# Altium project PCB_Robot_Sumo_2024.PrjPcb
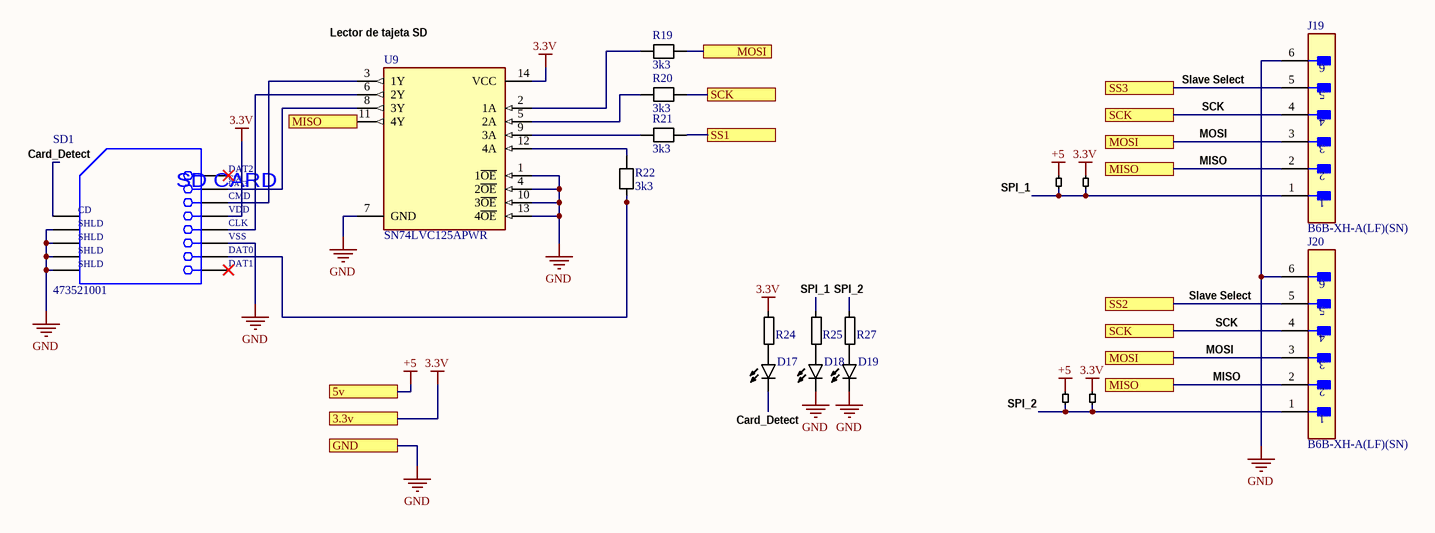
[diagram p0: SPI.SchDoc]
4 sheets, 41 parts. Net scope: flat (ports and power ports of the same name join across sheets).
Board file: PCB1.PcbDoc
Sheets:
  SPI.SchDoc
  QTR.SchDoc
  UART.SchDoc
  Drivers.SchDoc

## Sheet SPI.SchDoc
size A4

### Parts
D17  597-3305-607F  [0805 LED]  (value not drawn)
D18  597-3305-607F  [0805 LED]  (value not drawn)
D19  597-3305-607F  [0805 LED]  (value not drawn)
J19  B6B-XH-A(LF)(SN)  [FP-B6B-XH-A_LF_SN-MFG]
J20  B6B-XH-A(LF)(SN)  [FP-B6B-XH-A_LF_SN-MFG]
R19  3k3  [1206]
R20  3k3  [1206]
R21  3k3  [1206]
R22  3k3  [1206]
R24  CR0805-JW-221ELF  [0805 res]  (value not drawn)
R25  CR0805-JW-221ELF  [0805 res]  (value not drawn)
R27  CR0805-JW-221ELF  [0805 res]  (value not drawn)
SD1  473521001  [MOLX-473521001_V]
U9  SN74LVC125APWR  [FP-PW0014A-IPC_B]
W2  Jumper  [Jumper Mid]  (value not drawn)
W9  Jumper  [Jumper Mid]  (value not drawn)
W10  Jumper  [Jumper Mid]  (value not drawn)
W11  Jumper  [Jumper Mid]  (value not drawn)

### Ports
3.3v, 5v, GND, MISO, MOSI, SCK, SS1, SS2, SS3

### Nets
3.3V: R24.1 SD1.4(VDD) U9.14(VCC) W10.2 W11.2 ; port 3.3v
+5: W2.2 W9.2 ; port 5v
GND: D18.C D19.C J19.6 J20.6 SD1.6(VSS) SD1.10(SHLD) SD1.11(SHLD) SD1.12(SHLD) SD1.13(SHLD) U9.1(1~{OE}) U9.4(2~{OE}) U9.7(GND) U9.10(3~{OE}) U9.13(4~{OE}) ; port GND
Card_Detect: D17.C SD1.9(CD)
SPI_1: J19.1 R25.1 W2.1 W10.1
SPI_2: J20.1 R27.1 W9.1 W11.1
NetD17_A: D17.A R24.2
NetD18_A: D18.A R25.2
NetD19_A: D19.A R27.2
NetJ19_2: J19.2 J20.2 U9.11(4Y) ; port MISO
NetJ19_3: J19.3 J20.3 R19.2 ; port MOSI
NetJ19_4: J19.4 J20.4 R20.2 ; port SCK
NetJ19_5: J19.5 ; port SS3
NetJ20_5: J20.5 ; port SS2
NetR19_1: R19.1 U9.2(1A)
NetR20_1: R20.1 U9.5(2A)
NetR21_1: R21.1 U9.9(3A)
NetR21_2: R21.2 ; port SS1
NetR22_1: R22.1 U9.12(4A)
NetR22_2: R22.2 SD1.7(DAT0)
NetSD1_2: SD1.2(CD/DAT3) U9.8(3Y)
NetSD1_3: SD1.3(CMD) U9.3(1Y)
NetSD1_5: SD1.5(CLK) U9.6(2Y)

Not connected (* = marked no-connect by the designer): SD1 1(DAT2)* 8(DAT1)*

### Notes on the sheet
- (near U9) Lector de tajeta SD
- Slave Select
- SCK
- MOSI
- MISO
- (near J20) Slave Select
- (in symbol CMP-2000-05848-1) CD/; DAT3; SD CARD

### Library data of the parts
D17-D19 = 597-3305-607F: LED Uni-Color Green 4-Pin Chip 0805 T/R; Availability: Unavailable; Value: *; Price: None; MP: 597-3305-607F; Package: None
J19 J20 = CMP-17439-000076-1: CONN HEADER VERT 6POS 2.5MM
R19-R22 = RGC1206DTC10K0: Package: None; Price: None; Value: *; MP: RGC1206DTC10K0; Availability: Unavailable
R24 R25 R27 = CR0805-JW-221ELF: 220 Ohms Â±5% 0.125W, 1/8W Chip Resistor 0805 (2012 Metric) Moisture Resistant Thick Film; MF: Bourns; Value: *; Check_prices: https://www.snapeda.com/parts/CR0805-JW-221ELF/Bourns/view-part/?ref=eda; MP: CR0805-JW-221ELF; Price: None; Package: 2012 Bourns; Availability: In Stock; SnapEDA_Link: https://www.snapeda.com/parts/CR0805-JW-221ELF/Bourns/view-part/?ref=snap; Purchase-URL: https://pricing.snapeda.com/search/part/CR0805-JW-221ELF/?ref=eda
SD1 = CMP-2000-05848-1: MicroSD(TM), Pitch 1.1 mm, 8 Position, Height 1.88 mm, -20 to 85 degC, RoHS, Tape and Reel; Manufacturer: Molex; Datasheet Version: Rev. G, 01/2012; Datasheet URL: http://www.molex.com/pdm_docs/sd/473521001_sd.pdf; Package Reference: 473521001; Manufacturer URL: http://www.molex.com/; Mounting Technology: SurfaceMount; Package Description: MicroSD(TM), Pitch 1.1 mm, 8 Position, Height 1.88 mm
U9 = CMP-0440-00179-4: IC BUF NON-INVERT 3.6V 14TSSOP; Max Power Dissipation: 500mW; Number of Bits per Element: 1; Number of Bits: 4; Quiescent Current: 1uA; Min Supply Voltage: 1.65V; Propagation Delay: 4.6ns; High Level Output Current: -24mA; Logic Function: Buffer; Low Level Output Current: 24mA; Polarity: Non-Inverting; Turn-On Delay Time: 5.3ns; Number of Output Lines: 3; Mount: Surface Mount; Lead Free: Lead Free; Number of Outputs: 4; Max Supply Voltage: 3.6V; Packaging: Tape and Reel; Radiation Hardening: No; Number of Channels: 4; REACH SVHC: No SVHC; Length: 5mm; Number of Elements: 4; Contact Plating: Gold; Case/Package: TSSOP; Number of Input Lines: 4; Number of Inputs: 4; Height: 1.15mm; Number of Circuits: 4; Termination: SMD/SMT; Min Operating Temperature: -40°C; Package Quantity: 1; Number of Gates: 4; Max Operating Temperature: 125°C; Width: 4.4mm; Number of Pins: 14

## Sheet QTR.SchDoc
size A4
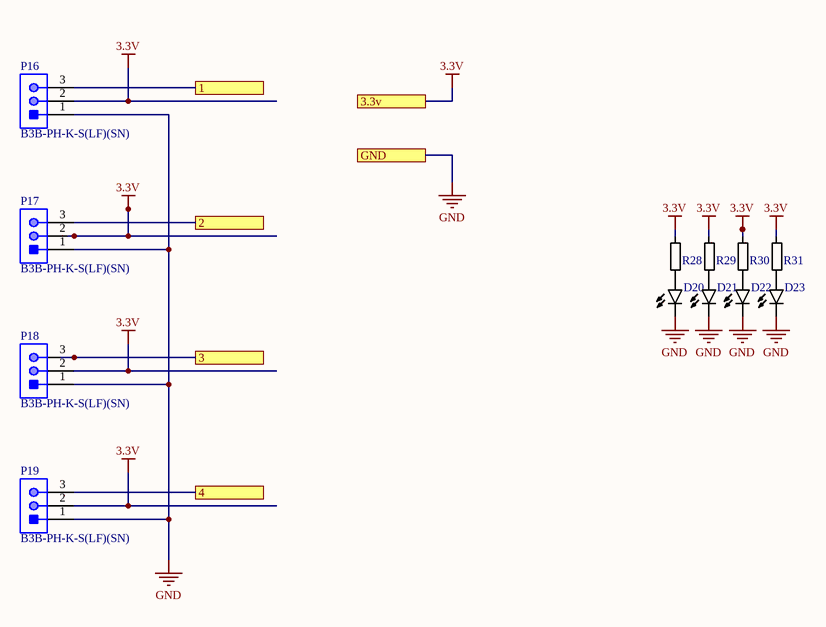
[diagram p1: QTR.SchDoc]

### Parts
D20  597-3305-607F  [0805 LED]  (value not drawn)
D21  597-3305-607F  [0805 LED]  (value not drawn)
D22  597-3305-607F  [0805 LED]  (value not drawn)
D23  597-3305-607F  [0805 LED]  (value not drawn)
P16  B3B-PH-K-S(LF)(SN)  [JST-B3B-PH-K-S-3_V]
P17  B3B-PH-K-S(LF)(SN)  [JST-B3B-PH-K-S-3_V]
P18  B3B-PH-K-S(LF)(SN)  [JST-B3B-PH-K-S-3_V]
P19  B3B-PH-K-S(LF)(SN)  [JST-B3B-PH-K-S-3_V]
R28  CR0805-JW-221ELF  [0805 res]  (value not drawn)
R29  CR0805-JW-221ELF  [0805 res]  (value not drawn)
R30  CR0805-JW-221ELF  [0805 res]  (value not drawn)
R31  CR0805-JW-221ELF  [0805 res]  (value not drawn)

### Ports
1, 2, 3, 3.3v, 4, GND

### Nets
3.3V: P16.2 P17.2 P18.2 P19.2 R28.1 R29.1 R30.1 R31.1 ; port 3.3v
GND: D20.C D21.C D22.C D23.C P16.1 P17.1 P18.1 P19.1 ; port GND
NetD20_A: D20.A R28.2
NetD21_A: D21.A R29.2
NetD22_A: D22.A R30.2
NetD23_A: D23.A R31.2
NetP16_3: P16.3 ; port 1
NetP17_3: P17.3 ; port 2
NetP18_3: P18.3 ; port 3
NetP19_3: P19.3 ; port 4

### Library data of the parts
D20-D23 = 597-3305-607F: LED Uni-Color Green 4-Pin Chip 0805 T/R; Availability: Unavailable; Value: *; Price: None; MP: 597-3305-607F; Package: None
P16-P19 = CMP-2000-05164-1: Male Header, Pitch 2 mm, 1 x 3 Position, Height 6 mm, Tail Length 3.4 mm, -25 to 85 degC, RoHS, Bulk; Manufacturer: JST; Style/Orientation: StraightHeader/Plug; Pitch: 2mm; No of Positions: 3; Termination: Crimp; Manufacturer URL: http://www.jst.com/home2.html; Datasheet Version: Oct-06; Type: ShroudedHeader; Datasheet URL: https://datasheet.ciiva.com/11746/0900766b80826550-11746939.pdf
R28-R31 = CR0805-JW-221ELF: as R24 on sheet SPI; Value: *; Check_prices: https://www.snapeda.com/parts/CR0805-JW-221ELF/Bourns/view-part/?ref=eda; MP: CR0805-JW-221ELF; Price: None; Package: 2012 Bourns; Availability: In Stock; SnapEDA_Link: https://www.snapeda.com/parts/CR0805-JW-221ELF/Bourns/view-part/?ref=snap; Purchase-URL: https://pricing.snapeda.com/search/part/CR0805-JW-221ELF/?ref=eda

## Sheet UART.SchDoc
size A4
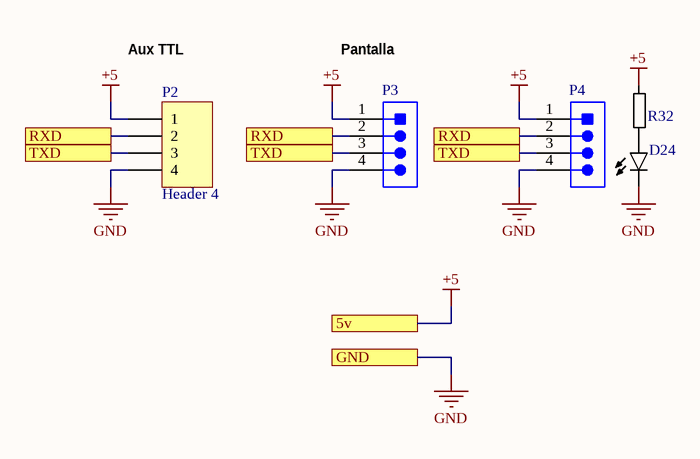
[diagram p2: UART.SchDoc]

### Parts
D24  597-3305-607F  [0805 LED]  (value not drawn)
P2  Header 4  [HDR1X4]
P3  B4B-PH-K-S(LF)(SN)  [JST-B4B-PH-K-S_V]  (value not drawn)
P4  B4B-PH-K-S(LF)(SN)  [JST-B4B-PH-K-S_V]  (value not drawn)
R32  CR0805-JW-221ELF  [0805 res]  (value not drawn)

### Ports
5v, GND, RXD, TXD

### Nets
+5: P2.1 P3.1 P4.1 R32.1 ; port 5v
GND: D24.C P2.4 P3.4 P4.4 ; port GND
NetD24_A: D24.A R32.2
NetP2_2: P2.2 P3.2 P4.2 ; port RXD
NetP2_3: P2.3 P3.3 P4.3 ; port TXD

### Notes on the sheet
- (near P2) Aux TTL
- (near P3) Pantalla

### Library data of the parts
D24 = 597-3305-607F: LED Uni-Color Green 4-Pin Chip 0805 T/R; Availability: Unavailable; Value: *; Price: None; MP: 597-3305-607F; Package: None
P2 = Header 4: Header, 4-Pin; LatestRevisionDate: 17-Jul-2002; LatestRevisionNote: Re-released for DXP Platform.; Publisher: Altium Limited
P3 P4 = CMP-2000-05165-1: Male Header, Pitch 2 mm, 1 x 4 Position, Height 6 mm, Tail Length 3.4 mm, -25 to 85 degC, RoHS, Bulk; Manufacturer: JST; No of Positions: 4; Style/Orientation: StraightHeader/Plug; Pitch: 2mm; Datasheet URL: http://datasheet.octopart.com/B4B-PH-K-S%28LF%29%28SN%29-JST-datasheet-10558886.pdf; Type: ShroudedHeader; Manufacturer URL: http://www.jst.com/home2.html; Termination: Crimp; Datasheet Version: Apr-09
R32 = CR0805-JW-221ELF: as R24 on sheet SPI; Value: *; Check_prices: https://www.snapeda.com/parts/CR0805-JW-221ELF/Bourns/view-part/?ref=eda; MP: CR0805-JW-221ELF; Price: None; Package: 2012 Bourns; Availability: In Stock; SnapEDA_Link: https://www.snapeda.com/parts/CR0805-JW-221ELF/Bourns/view-part/?ref=snap; Purchase-URL: https://pricing.snapeda.com/search/part/CR0805-JW-221ELF/?ref=eda

## Sheet Drivers.SchDoc
size A4
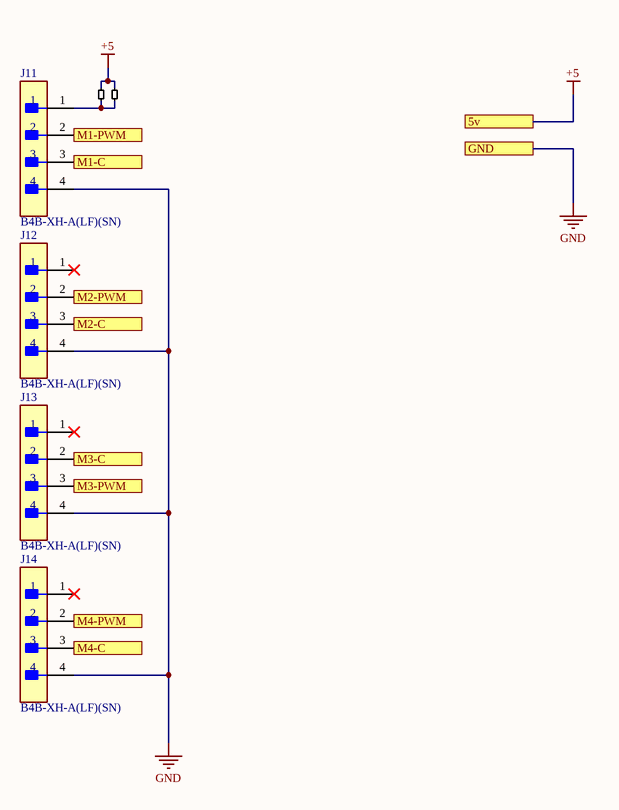
[diagram p3: Drivers.SchDoc]

### Parts
J11  B4B-XH-A(LF)(SN)  [FP-B4B-XH-A_LF_SN-MFG]
J12  B4B-XH-A(LF)(SN)  [FP-B4B-XH-A_LF_SN-MFG]
J13  B4B-XH-A(LF)(SN)  [FP-B4B-XH-A_LF_SN-MFG]
J14  B4B-XH-A(LF)(SN)  [FP-B4B-XH-A_LF_SN-MFG]
W30  Jumper  [Jumper Mid]  (value not drawn)
W31  Jumper  [Jumper Mid]  (value not drawn)

### Ports
5v, GND, M1-C, M1-PWM, M2-C, M2-PWM, M3-C, M3-PWM, M4-C, M4-PWM

### Nets
+5: W30.2 W31.2 ; port 5v
GND: J11.4 J12.4 J13.4 J14.4 ; port GND
NetJ11_1: J11.1 W30.1 W31.1
NetJ11_2: J11.2 ; port M1-PWM
NetJ11_3: J11.3 ; port M1-C
NetJ12_2: J12.2 ; port M2-PWM
NetJ12_3: J12.3 ; port M2-C
NetJ13_2: J13.2 ; port M3-C
NetJ13_3: J13.3 ; port M3-PWM
NetJ14_2: J14.2 ; port M4-PWM
NetJ14_3: J14.3 ; port M4-C

Not connected (* = marked no-connect by the designer): J12 1*; J13 1*; J14 1*

### Library data of the parts
J11-J14 = CMP-17439-000250-1: CONN HEADER VERT 4POS 2.5MM; Number of Contacts: 4; Contact Resistance: 20mR; Voltage Rating: 250V; Max Current Rating: 3A; Gender: Male; Wire/Cable Gauge: 22AWG; Mated Stacking Heights: 9.8mm; Insulation Resistance: 1GR; Orientation: Straight; Contact Type: Male Pin; Contact Finish - Mating: TIN; Series: XH; Max Voltage Rating (AC): 250V; Lead Pitch: 2.5mm; Contact Shape: Square; Insulation Color: Natural; Termination: Solder; Lead Free: Lead Free; Voltage Rating (AC): 250V; Number of Rows: 1; Flammability Rating: UL94 V-0; Number of Positions: 4; Max Operating Temperature: 85°C; Package Quantity: 500; Mount: Through Hole; REACH SVHC: No SVHC; Connector Type: Header; Insulation Material: Nylon; Fastening Type: Detent; Min Operating Temperature: -25°C; Housing Color: White; Packaging: Bulk; Contact Plating: Tin; Contact Material: Brass; Max Voltage Rating (DC): 250V; Housing Material: Polyamide; Color: Natural; Material: Polyamide; Pitch: 2.5mm; Depth: 5.75mm; Current Rating: 3A; Length: 12.4mm

## Nets that join several sheets
3.3V: SPI (5 pins), QTR (8 pins)
+5: SPI (W2.2 W9.2), UART (P2.1 P3.1 P4.1 R32.1), Drivers (W30.2 W31.2)
GND: SPI (14 pins), QTR (8 pins), UART (D24.C P2.4 P3.4 P4.4), Drivers (J11.4 J12.4 J13.4 J14.4)